# EAGLE design Dev_dsPIC_DIP (EAGLE 6.4)
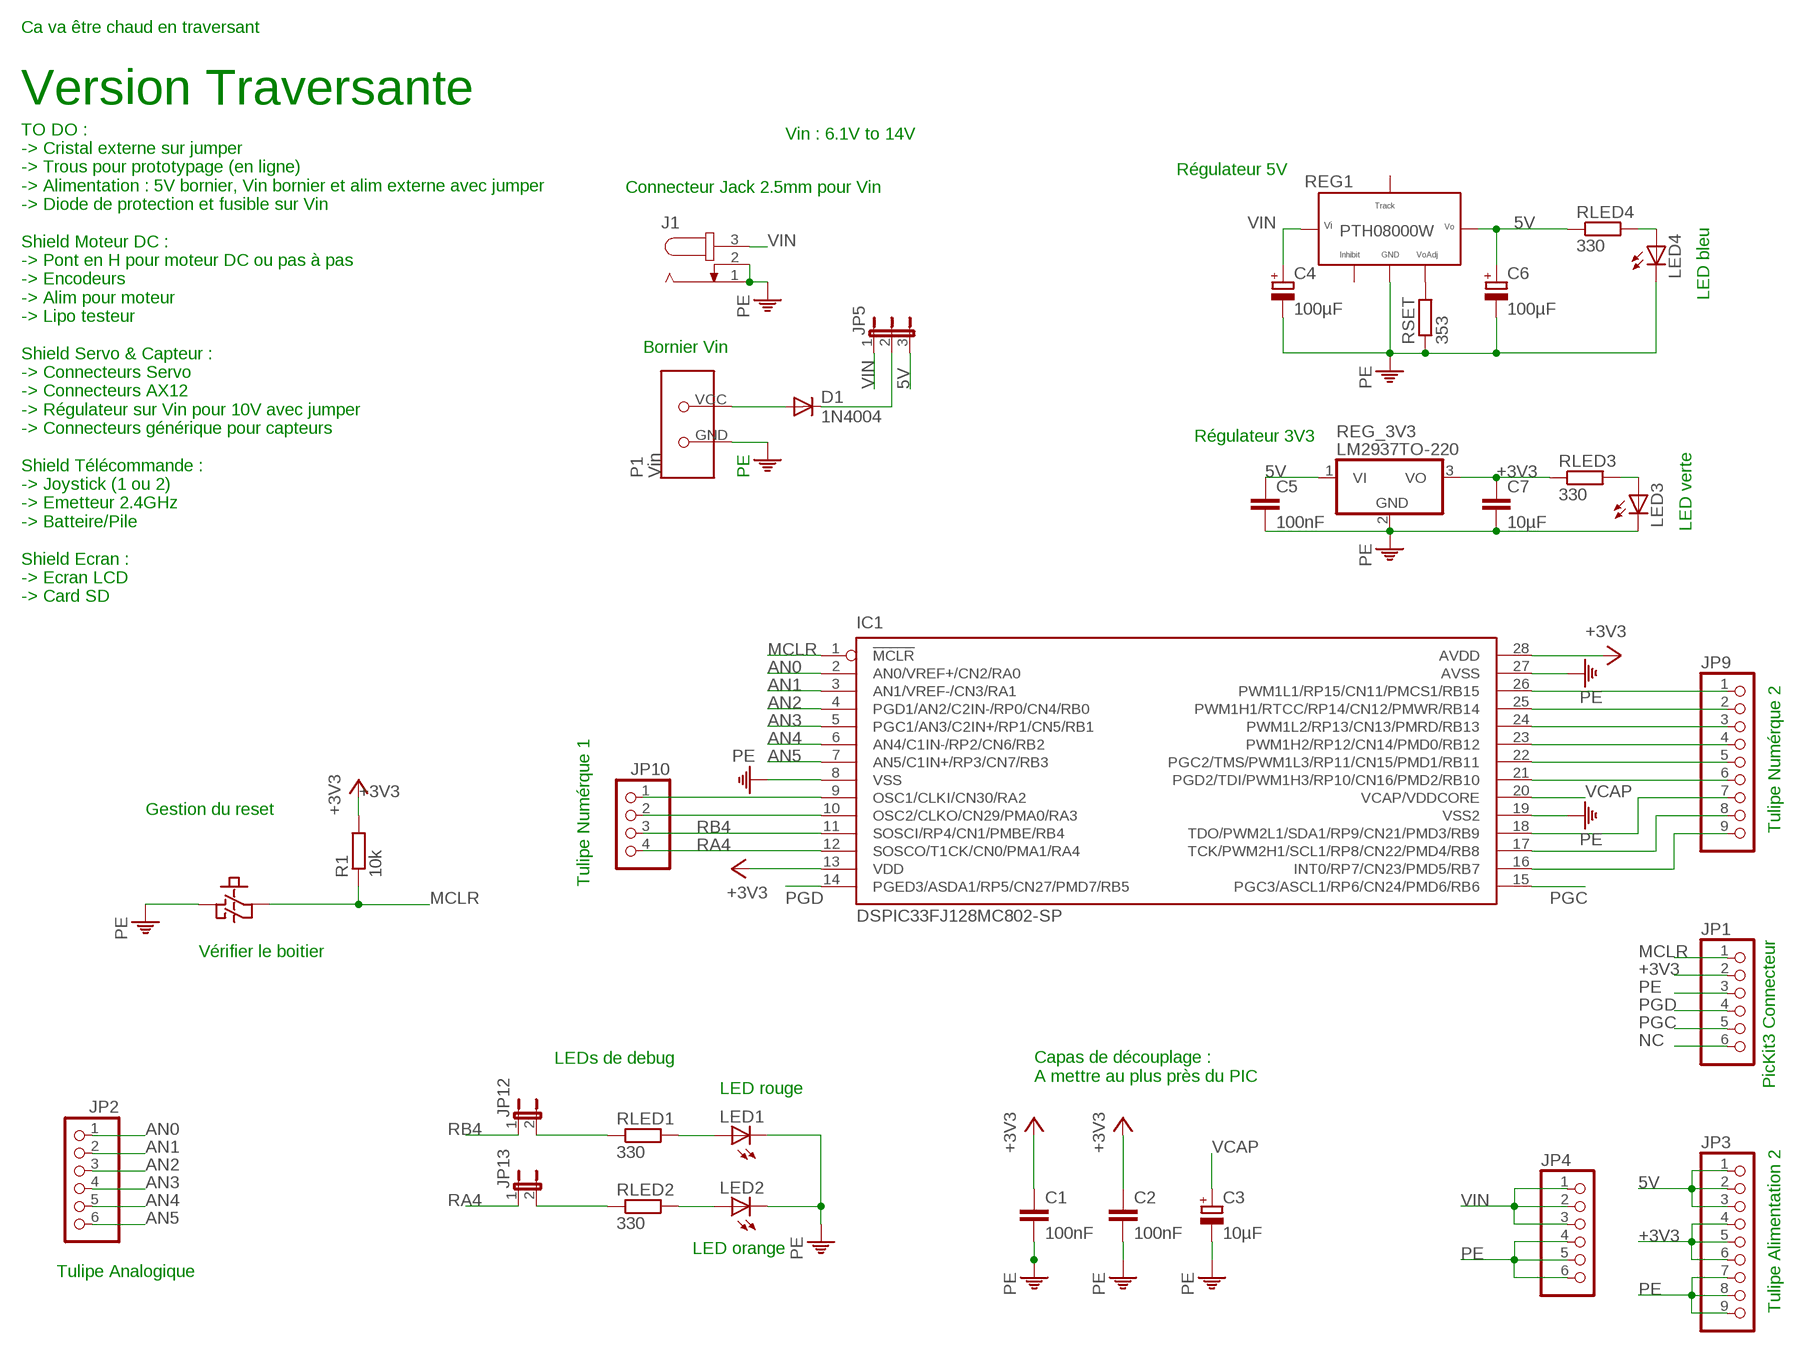
[diagram p0: schematic, sheet 1]

## Parts
C1  100nF  C-EU050-035X075  [C050-035X075]
C2  100nF  C-EU050-035X075  [C050-035X075]
C3  10µF  CPOL-EUE2.5-5V  [E2,5-4R]
C4  100µF  CPOL-EUE3.5-8  [E3,5-8]
C5  100nF  C-EU050-035X075  [C050-035X075]
C6  100µF  CPOL-EUE3.5-8  [E3,5-8]
C7  10µF  C-EU050-035X075  [C050-035X075]
D1  1N4004  [DO41-10]
IC1  DSPIC33FJ128MC802-SP  [DIL28-3]
J1  JACK-PLUG1  [SPC4078]
JP1  PINHD-1X6/90  [1X06/90]
JP2  PINHD-1X6  [1X06]
JP3  PINHD-1X9  [1X09]
JP4  PINHD-1X6  [1X06]
JP5  JP2E  [JP2]
JP9  PINHD-1X9  [1X09]
JP10  PINHD-1X4  [1X04]
JP12  JP1E  [JP1]
JP13  JP1E  [JP1]
LED1  LED3MM  [LED3MM]
LED2  LED3MM  [LED3MM]
LED3  LED3MM  [LED3MM]
LED4  LED3MM  [LED3MM]
P1  Vin  BORNIER_3.5MM  [BORNIER_COUDEE_3.5]
R1  10k  RES_PERSO  [RES_DIP_PERSO]
REG1  PTH08000W(EUS)  [TRHOUGH_HOLE_(EUS)]
REG_3V3  LM2937TO-220  [TO220V]
RLED1  330  RES_PERSO  [RES_DIP_PERSO]
RLED2  330  RES_PERSO  [RES_DIP_PERSO]
RLED3  330  RES_PERSO  [RES_DIP_PERSO]
RLED4  330  RES_PERSO  [RES_DIP_PERSO]
RSET  353  RES_PERSO  [RES_DIP_PERSO]
U$1  BP  [BP]

## Nets
5V: C5.1 C6.+ JP3.1 JP3.2 JP3.3 JP5.3 REG1.6 REG_3V3.1(VI) RLED4.1
+3V3: C1.1 C2.1 C7.1 IC1.13(VDD) IC1.28(AVDD) JP1.2 JP3.4 JP3.5 JP3.6 R1.2 REG_3V3.3(VO) RLED3.1
AN0: IC1.2(AN0/VREF+/CN2/RA0) JP2.1
AN1: IC1.3(AN1/VREF-/CN3/RA1) JP2.2
AN2: IC1.4(PGD1/AN2/C2IN-/RP0/CN4/RB0) JP2.3
AN3: IC1.5(PGC1/AN3/C2IN+/RP1/CN5/RB1) JP2.4
AN4: IC1.6(AN4/C1IN-/RP2/CN6/RB2) JP2.5
AN5: IC1.7(AN5/C1IN+/RP3/CN7/RB3) JP2.6
MCLR: IC1.1(!MCLR) JP1.1 R1.1 U$1.3 U$1.4
N$1: IC1.26(PWM1L1/RP15/CN11/PMCS1/RB15) JP9.1
N$2: IC1.25(PWM1H1/RTCC/RP14/CN12/PMWR/RB14) JP9.2
N$3: IC1.24(PWM1L2/RP13/CN13/PMRD/RB13) JP9.3
N$4: IC1.23(PWM1H2/RP12/CN14/PMD0/RB12) JP9.4
N$5: IC1.22(PGC2/TMS/PWM1L3/RP11/CN15/PMD1/RB11) JP9.5
N$6: IC1.21(PGD2/TDI/PWM1H3/RP10/CN16/PMD2/RB10) JP9.6
N$7: IC1.18(TDO/PWM2L1/SDA1/RP9/CN21/PMD3/RB9) JP9.7
N$8: IC1.17(TCK/PWM2H1/SCL1/RP8/CN22/PMD4/RB8) JP9.8
N$9: IC1.16(INT0/RP7/CN23/PMD5/RB7) JP9.9
N$10: IC1.9(OSC1/CLKI/CN30/RA2) JP10.1
N$11: IC1.10(OSC2/CLKO/CN29/PMA0/RA3) JP10.2
N$12: LED2.A RLED2.2
N$13: LED1.A RLED1.2
N$14: LED3.A RLED3.2
N$15: JP12.2 RLED1.1
N$16: JP13.2 RLED2.1
N$17: D1.A P1.VCC
N$20: REG1.5 RSET.2
N$21: LED4.A RLED4.2
NC: JP1.6
PE: C1.2 C2.2 C3.- C4.- C5.2 C6.- C7.2 IC1.8(VSS) IC1.19(VSS2) IC1.27(AVSS) J1.1 J1.2 JP1.3 JP3.7 JP3.8 JP3.9 JP4.4 JP4.5 JP4.6 LED1.K(C) LED2.K(C) LED3.K(C) LED4.K(C) P1.GND REG1.1 REG_3V3.2(GND) RSET.1 U$1.1 U$1.2
PGC: IC1.15(PGC3/ASCL1/RP6/CN24/PMD6/RB6) JP1.5
PGD: IC1.14(PGED3/ASDA1/RP5/CN27/PMD7/RB5) JP1.4
RA4: IC1.12(SOSCO/T1CK/CN0/PMA1/RA4) JP10.4 JP13.1
RB4: IC1.11(SOSCI/RP4/CN1/PMBE/RB4) JP10.3 JP12.1
VCAP: C3.+ IC1.20(VCAP/VDDCORE)
VCC: D1.C JP5.2
VIN: C4.+ J1.3 JP4.1 JP4.2 JP4.3 JP5.1 REG1.3
Unconnected: REG1.2 REG1.4

## Notes on the sheet
- Ca va être chaud en traversant
- Version Traversante
- TO DO : 
  -> Cristal externe sur jumper
  -> Trous pour prototypage (en ligne)
  -> Alimentation : 5V bornier, Vin bornier et alim externe avec jumper
  -> Diode de protection et fusible sur Vin
  
  Shield Moteur DC :
  -> Pont en H pour moteur DC ou pas à pas
  -> Encodeurs
  -> Alim pour moteur
  -> Lipo testeur
  
  Shield Servo & Capteur :
  -> Connecteurs Servo
  -> Connecteurs AX12
  -> Régulateur sur Vin pour 10V avec jumper
  -> Connecteurs générique pour capteurs
  
  Shield Télécommande :
  -> Joystick (1 ou 2)
  -> Emetteur 2.4GHz
  -> Batteire/Pile
  
  Shield Ecran :
  -> Ecran LCD
  -> Card SD
- Vin : 6.1V to 14V
- Régulateur 5V
- Connecteur Jack 2.5mm pour Vin
- LED bleu
- Bornier Vin
- Régulateur 3V3
- LED verte
- Gestion du reset
- Tulipe Numérque 2
- Tulipe Numérque 1
- PicKit3 Connecteur
- Vérifier le boitier
- LEDs de debug
- LED rouge
- Capas de découplage :
  A mettre au plus près du PIC
- LED orange
- Tulipe Analogique
- Tulipe Alimentation 2

## Library data of the parts
C1 C2 C5 C7 = rcl:C-EU: CAPACITOR, European symbol
C3 C4 C6 = rcl:CPOL-EU: POLARIZED CAPACITOR, European symbol
D1 = diode:1N4004: DIODE general purpose rectifier, 1 A
IC1 = microchip-dspic33fjxxmc:DSPIC33FJ128MC802: High-Performance, 16-bit Digital Signal Controllers - dsPIC33FJ32MC302/304, dsPIC33FJ64MCX02/X04, AND dsPIC33FJ128MCX02/X04 Package: 28-Pin SDIP, SOIC, QFN-S Operating Range: . Up to 40 MIPS operation (at 3.0-3.6V): - Industrial temperature range (-40°C to +85°C) - Extended temperature range (-40°C to +125°C) High-Performance DSC CPU: . Modified Harvard architecture . C compiler optimized instruction set . 16-bit wide data path . 24-bit wide instructions . Linear program memory addressing up to 4M instruction words . Linear data memory addressing up to 64 Kbytes . 83 base instructions: mostly 1 word/1 cycle . Two 40-bit accumulators with rounding and saturation options . Flexible and powerful addressing modes: - Indirect - Modulo - Bit-Reversed . Software stack . 16 x 16 fractional/integer multiply operations . 32/16 and 16/16 divide operations . Single-cycle multiply and accumulate: - Accumulator write back for DSP operations - Dual data fetch . Up to ±16-bit shifts for up to 40-bit data On-Chip Flash and SRAM: . Flash program memory . Data SRAM . Boot, Secure, and General Security for program Flash Direct Memory Access (DMA): . 8-channel hardware DMA . Up to 2 Kbytes dual ported DMA buffer area (DMA RAM) to store data transferred via DMA: - Allows data transfer between RAM and a peripheral while CPU is executing code (no cycle stealing) . Most peripherals support DMA Timers/Capture/Compare/PWM: . Timer/Counters, up to five 16-bit timers: - Can pair up to make two 32-bit timers - One timer runs as a Real-Time Clock with an external 32.768 kHz oscillator - Programmable prescaler . Input Capture (up to four channels): - Capture on up, down or both edges - 16-bit capture input functions - 4-deep FIFO on each capture . Output Compare (up to four channels): - Single or Dual 16-bit Compare mode - 16-bit Glitchless PWM mode . Hardware Real-Time Clock/Calendar (RTCC): - Provides clock, calendar, and alarm functions Interrupt Controller: . 5-cycle latency . 118 interrupt vectors . Up to 49 available interrupt sources . Up to three external interrupts . Seven programmable priority levels . Five processor exceptions Digital I/O: . Peripheral pin Select functionality . Up to 35 programmable digital I/O pins . Wake-up/Interrupt-on-Change for up to 21 pins . Output pins can drive from 3.0V to 3.6V . Up to 5V output with open drain configuration . All digital input pins are 5V tolerant . 4 mA sink on all I/O pins System Management: . Flexible clock options: - External, crystal, resonator, internal RC - Fully integrated Phase-Locked Loop (PLL) - Extremely low jitter PLL . Power-up Timer . Oscillator Start-up Timer/Stabilizer . Watchdog Timer with its own RC oscillator . Fail-Safe Clock Monitor . Reset by multiple sources Power Management: . On-chip 2.5V voltage regulator . Switch between clock sources in real time . Idle, Sleep, and Doze modes with fast wake-up Analog-to-Digital Converters (ADCs): . 10-bit, 1.1 Msps or 12-bit, 500 Ksps conversion: - Two and four simultaneous samples (10-bit ADC) - Up to 13 input channels with auto-scanning - Conversion start can be manual or synchronized with one of four trigger sources - Conversion possible in Sleep mode - ±2 LSb max integral nonlinearity - ±1 LSb max differential nonlinearity Audio Digital-to-Analog Converter (DAC): . 16-bit Dual Channel DAC module . 100 Ksps maximum sampling rate . Second-Order Digital Delta-Sigma Modulator Data Converter Interface (DCI) module: . Codec interface . Supports I2S and AC.97 protocols . Up to 16-bit data words, up to 16 words per frame . 4-word deep TX and RX buffers Comparator Module: . Two analog comparators with programmable input/output configuration CMOS Flash Technology: . Low-power, high-speed Flash technology . Fully static design . 3.3V (±10%) operating voltage . Industrial and Extended temperature . Low power consumption Communication Modules: . 4-wire SPI (up to two modules): - Framing supports I/O interface to simple codecs - Supports 8-bit and 16-bit data - Supports all serial clock formats and sampling modes . I2C?: - Full Multi-Master Slave mode support - 7-bit and 10-bit addressing - Bus collision detection and arbitration - Integrated signal conditioning - Slave address masking . UART (up to two modules): - Interrupt on address bit detect - Interrupt on UART error - Wake-up on Start bit from Sleep mode - 4-character TX and RX FIFO buffers - LIN bus support - IrDA® encoding and decoding in hardware - High-Speed Baud mode - Hardware Flow Control with CTS and RTS . Enhanced CAN (ECAN. module) 2.0B active: - Up to eight transmit and up to 32 receive buffers - 16 receive filters and three masks - Loopback, Listen Only and Listen All - Messages modes for diagnostics and bus monitoring - Wake-up on CAN message - Automatic processing of Remote Transmission Requests - FIFO mode using DMA - DeviceNet. addressing support . Parallel Master Slave Port (PMP/EPSP): - Supports 8-bit or 16-bit data - Supports 16 address lines . Programmable Cyclic Redundancy Check (CRC): - Programmable bit length for the CRC generator polynomial (up to 16-bit length) - 8-deep, 16-bit or 16-deep, 8-bit FIFO for data input
J1 = con-jack:JACK-PLUG: DC POWER JACK Power Jack, DC, Right Angle, Through Hole, Rated 5A at 16VDC, PC Terminals Distributor: Farnell (www.Farnell.de) Drawing: 84N1161.pdf / 84N1162.pdf Manufacturer: SPC Technology (www.spctechnology.com) Type: SPC4077 / SPC 4078; OC_FARNELL: unknown; OC_NEWARK: unknown
JP1 JP2 JP4 = pinhead:PINHD-1X6: PIN HEADER
JP3 JP9 = pinhead:PINHD-1X9: PIN HEADER
JP5 = jumper:JP2E: JUMPER
JP10 = pinhead:PINHD-1X4: PIN HEADER
JP12 JP13 = jumper:JP1E: JUMPER
LED1-LED4 = led:LED: LED OSRAM: - CHIPLED LG R971, LG N971, LY N971, LG Q971, LY Q971, LO R971, LY R971 LH N974, LH R974 LS Q976, LO Q976, LY Q976 LO Q996 - Hyper CHIPLED LW Q18S LB Q993, LB Q99A, LB R99A - SideLED LS A670, LO A670, LY A670, LG A670, LP A670 LB A673, LV A673, LT A673, LW A673 LH A674 LY A675 LS A676, LA A676, LO A676, LY A676, LW A676 LS A679, LY A679, LG A679 - Hyper Micro SIDELED® LS Y876, LA Y876, LO Y876, LY Y876 LT Y87S - SmartLED LW L88C, LW L88S LB L89C, LB L89S, LG L890 LS L89K, LO L89K, LY L89K LS L896, LA L896, LO L896, LY L896 - TOPLED LS T670, LO T670, LY T670, LG T670, LP T670 LSG T670, LSP T670, LSY T670, LOP T670, LYG T670 LG T671, LOG T671, LSG T671 LB T673, LV T673, LT T673, LW T673 LH T674 LS T676, LA T676, LO T676, LY T676, LB T676, LH T676, LSB T676, LW T676 LB T67C, LV T67C, LT T67C, LS T67K, LO T67K, LY T67K, LW E67C LS E67B, LA E67B, LO E67B, LY E67B, LB E67C, LV E67C, LT E67C LW T67C LS T679, LY T679, LG T679 LS T770, LO T770, LY T770, LG T770, LP T770 LB T773, LV T773, LT T773, LW T773 LH T774 LS E675, LA E675, LY E675, LS T675 LS T776, LA T776, LO T776, LY T776, LB T776 LHGB T686 LT T68C, LB T68C - Hyper Mini TOPLED® LB M676 - Mini TOPLED Santana® LG M470 LS M47K, LO M47K, LY M47K Source: http://www.osram.convergy.de LUXEON: - LUMILED® LXK2-PW12-R00, LXK2-PW12-S00, LXK2-PW14-U00, LXK2-PW14-V00 LXK2-PM12-R00, LXK2-PM12-S00, LXK2-PM14-U00 LXK2-PE12-Q00, LXK2-PE12-R00, LXK2-PE12-S00, LXK2-PE14-T00, LXK2-PE14-U00 LXK2-PB12-K00, LXK2-PB12-L00, LXK2-PB12-M00, LXK2-PB14-N00, LXK2-PB14-P00, LXK2-PB14-Q00 LXK2-PR12-L00, LXK2-PR12-M00, LXK2-PR14-Q00, LXK2-PR14-R00 LXK2-PD12-Q00, LXK2-PD12-R00, LXK2-PD12-S00 LXK2-PH12-R00, LXK2-PH12-S00 LXK2-PL12-P00, LXK2-PL12-Q00, LXK2-PL12-R00 Source: www.luxeon.com KINGBRIGHT: KA-3528ASYC Source: www.kingbright.com
P1 = Perso:BORNIER_3.5MM: Bornier 3.5mm Bornier emfichable 3.5mm coudée
R1 RLED1-RLED4 RSET = Perso:RES_PERSO
REG1 = Perso:PTH08000W(EUS): PTH08000H Alimentation à découpage : Vin : 4.5V to 14V Vout : 0.9V to 5.5V Iout : 2.25A
REG_3V3 = linear:LM2937: LM2937-2.5, LM2937-3.3 400mA and 500mA Voltage Regulators Source: http://cache.national.com/ds/LM/LM2937-2.5.pdf
U$1 = Perso:BP: BP Bouton poussoir, 4 pins, 1 contact

## Board
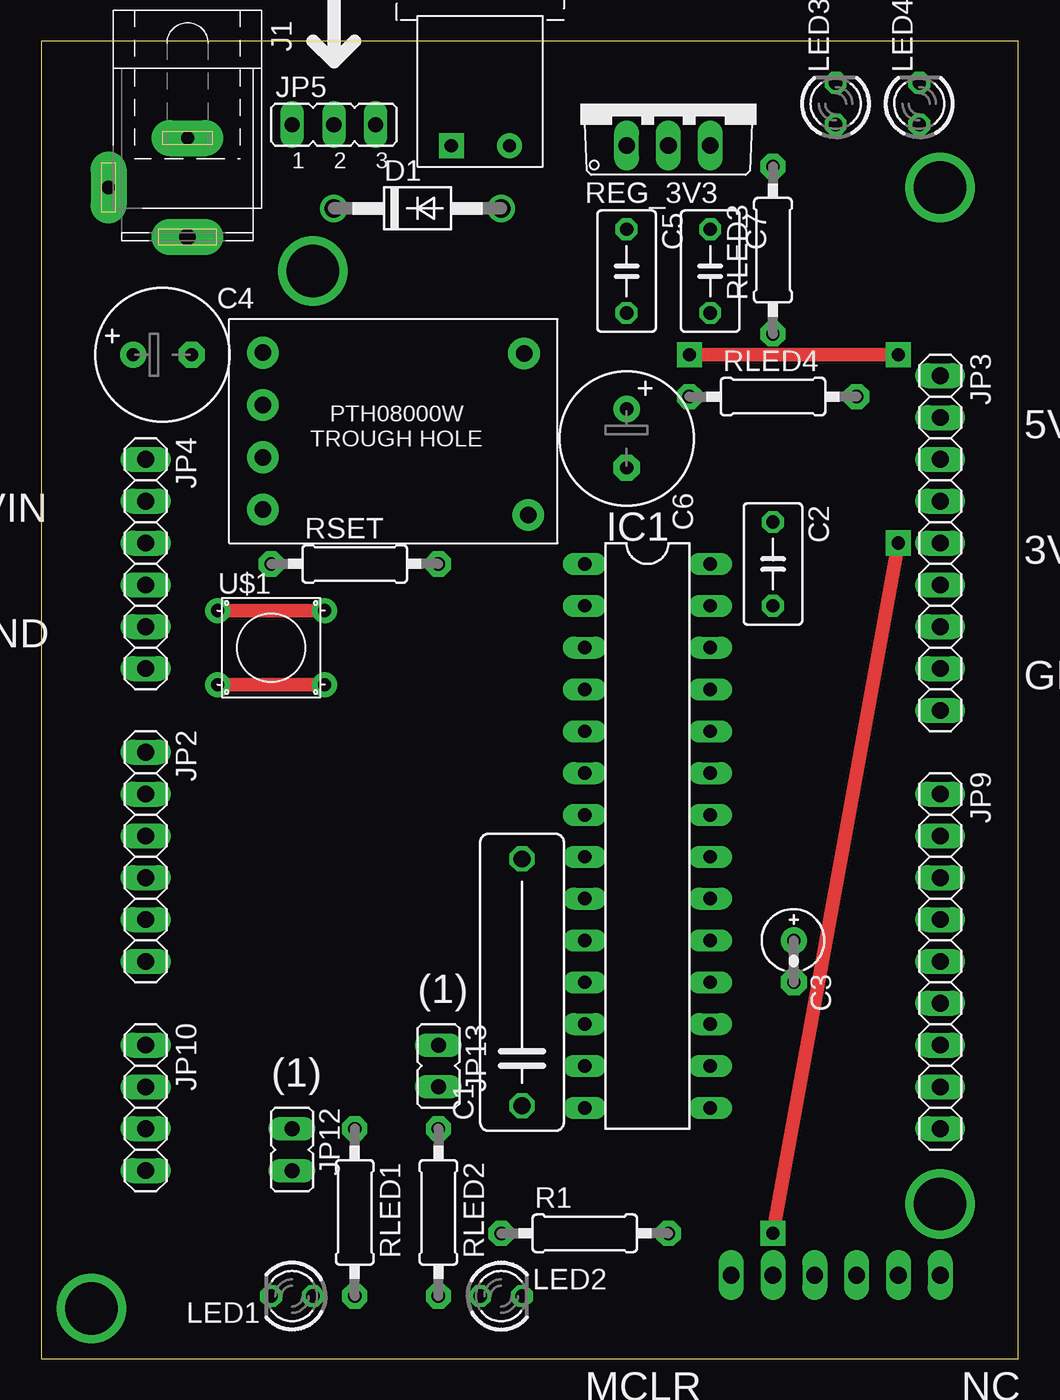
[diagram p1: board, top side]
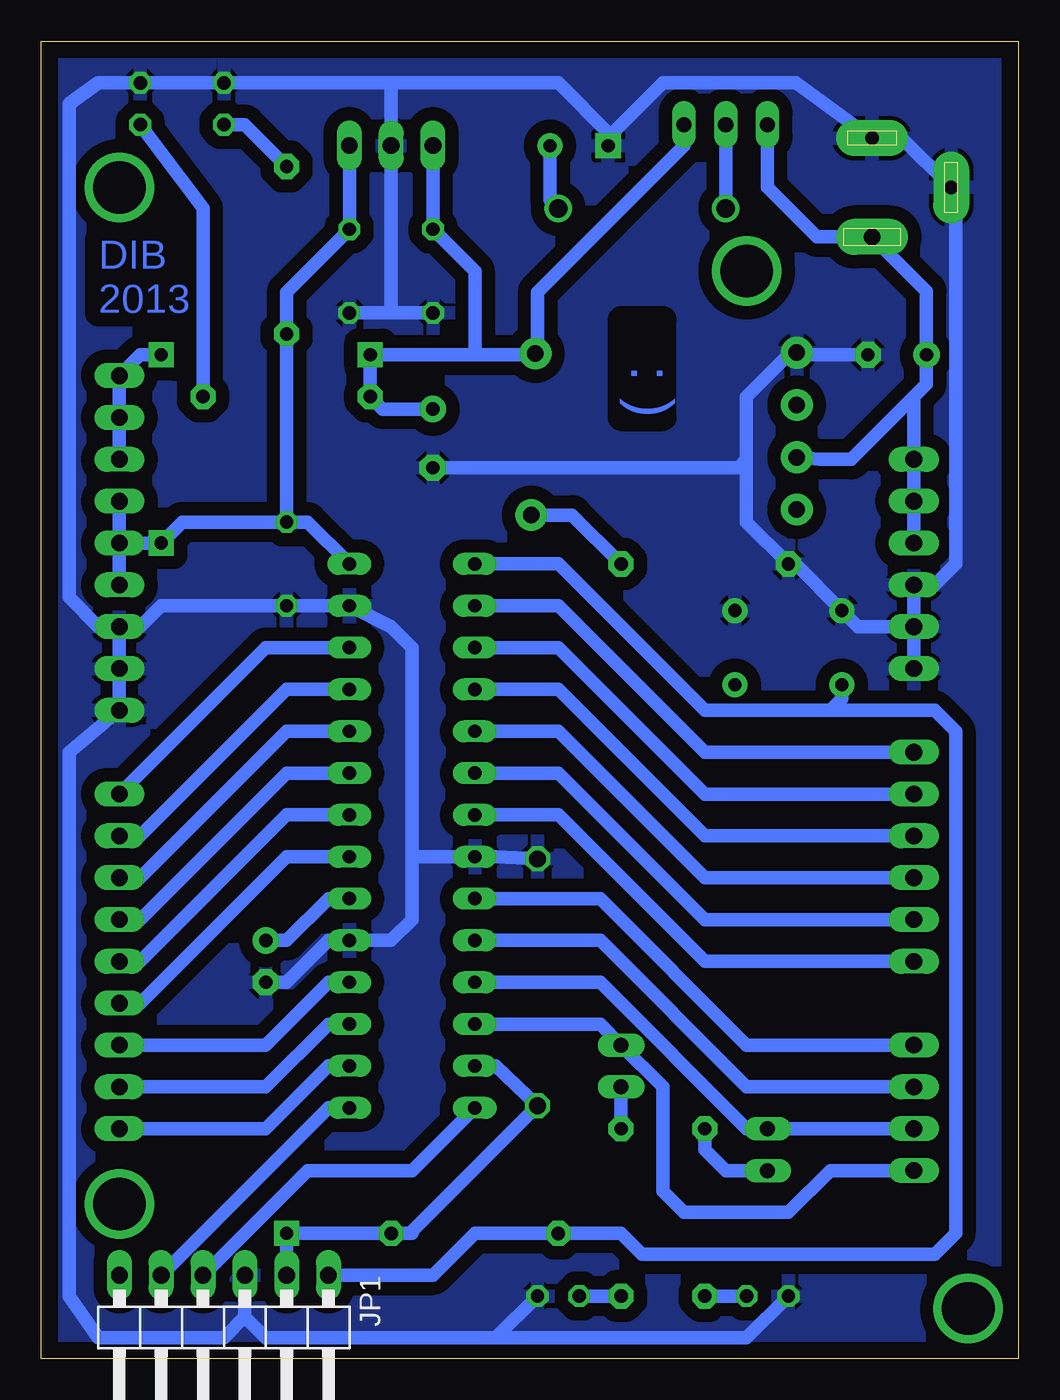
[diagram p2: board, bottom side, seen from below]

Size 59.36 x 80 mm. Coordinates in mm from the lower left corner, seen from the top.
Outline: 0,0 59.36,0 59.36,80 0,80 0,0
Copper layers (1*16): Top 0.035mm / dielectric 1.5mm / Bottom 0.035mm
Design rules "default": minimum track width 10mil, minimum drill 24mil, track to track 8mil, track to pad 8mil, pad to pad 8mil, via to via 8mil, smd to smd 8mil, copper to edge 40mil, drill to drill 8mil, minimum pad ring 10mil, minimum via ring 8mil, stop-mask expansion 4mil, vias tented up to drill 0mil, thermal gap 10mil

### Footprints (pad centres in the part's own frame; a part is rotated, then mirrored left to right if it is on the bottom)
C150-054X183 = drill 1.016 octagon: 1 -7.493,0; 2 7.493,0
C050-035X075 = drill 0.813 octagon: 1 -2.54,0; 2 2.54,0
E2,5-4R = drill 0.813 pad 1.6: + -1.27,0 | drill 0.813 pad 1.6 octagon: - 1.27,0
E3,5-8 = drill 0.813 pad 1.6: + -1.778,0 | drill 0.813 pad 1.6 octagon: - 1.778,0
DO41-10 = drill 1.118: A 5.08,0; C -5.08,0
DIL28-3 = drill 0.813 long: 1 -16.51,-3.81; 2 -13.97,-3.81; 3 -11.43,-3.81; 4 -8.89,-3.81; 5 -6.35,-3.81; 6 -3.81,-3.81; 7 -1.27,-3.81; 8 1.27,-3.81; 9 3.81,-3.81; 10 6.35,-3.81; 11 8.89,-3.81; 12 11.43,-3.81; 13 13.97,-3.81; 14 16.51,-3.81; 15 16.51,3.81; 16 13.97,3.81; 17 11.43,3.81; 18 8.89,3.81; 19 6.35,3.81; 20 3.81,3.81; 21 1.27,3.81; 22 -1.27,3.81; 23 -3.81,3.81; 24 -6.35,3.81; 25 -8.89,3.81; 26 -11.43,3.81; 27 -13.97,3.81; 28 -16.51,3.81
SPC4078 = drill 0.8 pad 2.184 long: 1 -3,0; 2 0,-4.8 | drill 1 pad 2.184 long: 3 3,0
1X06/90 = drill 1.016 long: 1 -6.35,-3.81; 2 -3.81,-3.81; 3 -1.27,-3.81; 4 1.27,-3.81; 5 3.81,-3.81; 6 6.35,-3.81
1X06 = drill 1.016 long: 1 -6.35,0; 2 -3.81,0; 3 -1.27,0; 4 1.27,0; 5 3.81,0; 6 6.35,0
1X09 = drill 1.016 long: 1 -10.16,0; 2 -7.62,0; 3 -5.08,0; 4 -2.54,0; 5 0,0; 6 2.54,0; 7 5.08,0; 8 7.62,0; 9 10.16,0
JP2 = drill 0.914 long: 1 -2.54,0; 2 0,0; 3 2.54,0
1X04 = drill 1.016 long: 1 -3.81,0; 2 -1.27,0; 3 1.27,0; 4 3.81,0
JP1 = drill 0.914 long: 1 0,-1.27; 2 0,1.27
LED3MM = drill 0.813 octagon: A -1.27,0; K 1.27,0
BORNIER_COUDEE_3.5 = drill 0.8 pad 1.524 square: GND 2.057,1.27 | drill 0.8 pad 1.524: VCC 5.588,1.27
RES_DIP_PERSO = drill 0.813 pad 1.524 octagon: 1 -5.08,0; 2 5.08,0
TRHOUGH_HOLE_(EUS) = drill 1 pad 1.93: 1 2.032,11.557; 2 2.032,8.382; 3 2.032,5.207; 4 2.032,2.032; 5 18.161,1.702; 6 17.907,11.506
TO220V = drill 1.016 long: 1 -2.54,-2.54; 2 0,-2.54; 3 2.54,-2.54
BP = drill 0.8 pad 1.524: 1 -3.25,2.25; 2 3.25,2.25; 3 -3.25,-2.25; 4 3.25,-2.25

### Placement (x,y rotation side)
C1  100nF  [C150-054X183]  29.21,22.86 90 top
C2  44.45,48.26 270 top
C3  45.72,24.13 270 top
C4  7.37,60.96 0 top
C5  35.56,66.04 270 top
C6  35.56,55.88 270 top
C7  40.64,66.04 270 top
D1  22.86,69.85 0 top
IC1  36.83,31.75 270 top
J1  8.89,71.12 270 top
JP1  48.26,1.27 180 bottom
JP2  6.35,30.48 270 top
JP3  54.61,49.53 270 top
JP4  6.35,48.26 270 top
JP5  17.78,74.93 0 top
JP9  54.61,24.13 270 top
JP10  6.35,15.24 270 top
JP12  15.24,12.7 180 top
JP13  24.13,17.78 180 top
LED1  15.24,3.81 180 top
LED2  27.94,3.81 0 top
LED3  48.26,76.2 90 top
LED4  53.34,76.2 90 top
P1  22.86,72.39 0 top
R1  33.02,7.62 0 top
REG1  11.43,49.53 0 top
REG_3V3  38.1,76.2 0 top
RLED1  19.05,8.89 270 top
RLED2  24.13,8.89 270 top
RLED3  44.45,67.31 90 top
RLED4  44.45,58.42 0 top
RSET  19.05,48.26 0 top
U$1  13.97,43.18 0 top

### Tracks (layer width: path | path; a pad name or v marks a point on that pad's centre or on a via)
5V  (via drill 0.8 pad 1.52)
  Top 0.813: v52.07,60.96 v39.37,60.96
  Bottom 0.813: JP3.1 JP3.2 JP3.3 JP3.1 | REG_3V3.1 C5.1 33.02,66.04 33.02,60.96 | 33.02,60.96 v39.37,60.96 RLED4.1 38.61,57.66 C6.+ | v52.07,60.96 53.34,60.96 JP3.1 | JP5.3 20.32,73.66 29.21,64.77 29.21,61.16 REG1.6 29.41,60.96 33.02,60.96
+3V3  (via drill 0.8 pad 1.52)
  Top 0.813: v52.07,49.53 v44.45,7.62
  Bottom 0.813: C2.1 43.18,50.8 IC1.28 | C1.1 29.21,15.24 | JP3.6 JP3.5 | JP3.5 JP3.4 | JP1.2 v44.45,7.62 R1.2 36.83,7.62 36.83,7.75 C1.1 | REG_3V3.3 C7.1 44.45,64.77 RLED3.1 C2.1 | JP3.5 v52.07,49.53 50.8,50.8 C2.1 | C1.1 31.75,17.78 IC1.13
AN0
  Bottom 0.813: IC1.2 27.94,45.72 19.05,36.83 JP2.1
AN1
  Bottom 0.813: IC1.3 27.94,43.18 19.05,34.29 JP2.2
AN2
  Bottom 0.813: JP2.3 19.05,31.75 27.94,40.64 IC1.4
AN3
  Bottom 0.813: IC1.5 27.94,38.1 19.05,29.21 JP2.4
AN4
  Bottom 0.813: IC1.6 27.94,35.56 19.05,26.67 JP2.5
AN5
  Bottom 0.813: JP2.6 19.05,24.13 27.94,33.02 IC1.7
HOLE1  (via drill 3.2)
  other vias: 3.05,3.05
HOLE2  (via drill 3.2)
  other vias: 54.61,9.4
HOLE3  (via drill 3.2)
  other vias: 54.61,71.12
HOLE4  (via drill 3.2)
  other vias: 16.51,66.04
MCLR
  Top 0.813: U$1.4 U$1.3
  Bottom 0.813: 32.97,48.21 IC1.1 27.94,48.26 19.05,39.37 11.43,39.37 | 11.43,39.37 5.08,39.37 3.81,38.1 3.81,7.62 5.08,6.35 22.86,6.35 24.13,7.62 R1.1 33.02,7.62 35.56,5.08 JP1.1 | U$1.3 10.72,40.08 11.43,39.37
N$1
  Bottom 0.813: IC1.26 45.72,43.18 JP9.1
N$2
  Bottom 0.813: JP9.2 53.34,31.75 44.45,40.64 IC1.25
N$3
  Bottom 0.813: JP9.3 53.34,29.21 44.45,38.1 IC1.24
N$4
  Bottom 0.813: JP9.4 53.34,26.67 44.45,35.56 IC1.23
N$5
  Bottom 0.813: JP9.5 53.34,24.13 44.45,33.02 IC1.22
N$6
  Bottom 0.813: IC1.21 44.45,30.48 53.34,21.59 JP9.6
N$7
  Bottom 0.813: IC1.18 41.91,22.86 45.72,19.05 JP9.7
N$8
  Bottom 0.813: IC1.17 41.91,20.32 45.72,16.51 JP9.8
N$9
  Bottom 0.813: IC1.16 41.91,17.78 45.72,13.97 JP9.9
N$10
  Bottom 0.813: JP10.1 16.51,19.05 25.4,27.94 IC1.9
N$11
  Bottom 0.813: JP10.2 16.51,16.51 25.4,25.4 IC1.10
N$12
  Bottom 0.813: RLED2.2 LED2.A
N$13
  Bottom 0.813: LED1.A RLED1.2
N$14
  Bottom 0.813: LED3.A 46.99,74.93 RLED3.2
N$15
  Bottom 0.813: JP12.2 17.78,11.43 19.05,12.7 RLED1.1
N$16
  Bottom 0.813: JP13.2 RLED2.1
N$17
  Bottom 0.813: P1.VCC 28.45,70.36 D1.A
N$20
  Bottom 0.813: RSET.2 27.1,51.23 REG1.5
N$21
  Bottom 0.813: LED4.A 49.53,69.85 RLED4.2
PE
  Top 0.813: U$1.1 U$1.2
  Bottom 0.813: 36.83,30.48 IC1.8 31.75,30.48 C1.2 | 46.99,2.54 45.72,1.27 31.75,1.27 | JP4.5 JP4.4 5.08,46.99 3.81,48.26 3.81,70.84 J1.2 7.09,74.12 J1.1 13.51,77.47 21.59,77.47 24.77,74.3 | JP4.6 JP4.5 | 36.83,30.48 36.83,43.18 38.1,44.45 IC1.27 C2.2 52.07,45.72 53.34,44.45 JP3.7 | 36.83,30.48 36.83,26.67 38.1,25.4 IC1.19 41.91,25.4 44.45,22.86 C3.- | JP1.3 46.99,2.54 | 46.99,2.54 48.26,1.27 55.88,1.27 57.66,3.81 57.66,36.83 JP3.9 JP3.8 JP3.7 | 38.1,63.5 REG_3V3.2 38.1,77.47 | C5.2 38.1,63.5 | C7.2 38.1,63.5 | 38.1,77.47 27.94,77.47 24.77,74.3 | P1.GND 24.92,74.14 24.77,74.3 | LED2.K 31.75,1.27 | LED1.K 16.51,1.27 31.75,1.27 | JP3.7 55.88,44.45 57.66,46.23 57.66,76.2 55.88,77.47 LED4.K LED3.K 38.1,77.47 | JP4.5 9.74,44.45 U$1.1 13.55,48.26 RSET.1 16.51,50.8 16.51,54.61 | 16.51,54.61 16.51,58.42 13.84,61.09 REG1.1 13.34,60.96 C4.- | C6.- 17.02,54.1 16.51,54.61
  pour Bottom (isolate 0.813): 0,0 59.69,0 59.69,80.01 0,80.01
PGC
  Bottom 0.813: IC1.15 41.91,15.24 JP1.5
PGD
  Bottom 0.813: IC1.14 36.83,11.43 43.18,11.43 JP1.4
RA4
  Bottom 0.813: IC1.12 25.4,20.32 JP13.1 21.59,16.51 21.59,10.16 20.32,8.89 13.97,8.89 11.43,11.43 JP10.4
RB4
  Bottom 0.813: JP10.3 JP12.1 16.51,13.97 25.4,22.86 IC1.11
VCAP
  Bottom 0.813: IC1.20 41.91,27.94 44.45,25.4 C3.+
VCC
  Bottom 0.813: JP5.2 D1.C
VIN
  Bottom 0.813: JP4.3 JP4.2 JP4.1 6.35,58.42 | JP5.1 15.24,71.12 12.24,68.12 J1.3 5.59,64.82 C4.+ 5.59,59.18 6.35,58.42 | 6.35,58.42 10.16,54.61 12.06,54.61 REG1.3

### Text on the board
Bottom: DIB / 2013 | ( :
tNames: Sélection de la tension du bornier : / Gauche -> V > 6.1V / Droit -> V = 5V | Carte de DEV dsPIC33 : / V1.1 / Base du kit de dev | 5V | VIN | 3V3 | GND | GND | Refaire les empreintes de led avec une plus grosse pastille et passer aux 5mm | (1) | (1) | MCLR | NC | (1) Connection des LEDs de debug